# Altium schematic sheet SME_mic841.SchDoc: Titulo
size OrCAD A; Author: Ismael Poblete V.; CompanyName: SME; Organization: SME; Address1: Santiago, Chile; DocumentNumber: SME-UNO; Revision: 1.0; SheetNumber: 2; SheetTotal: 7
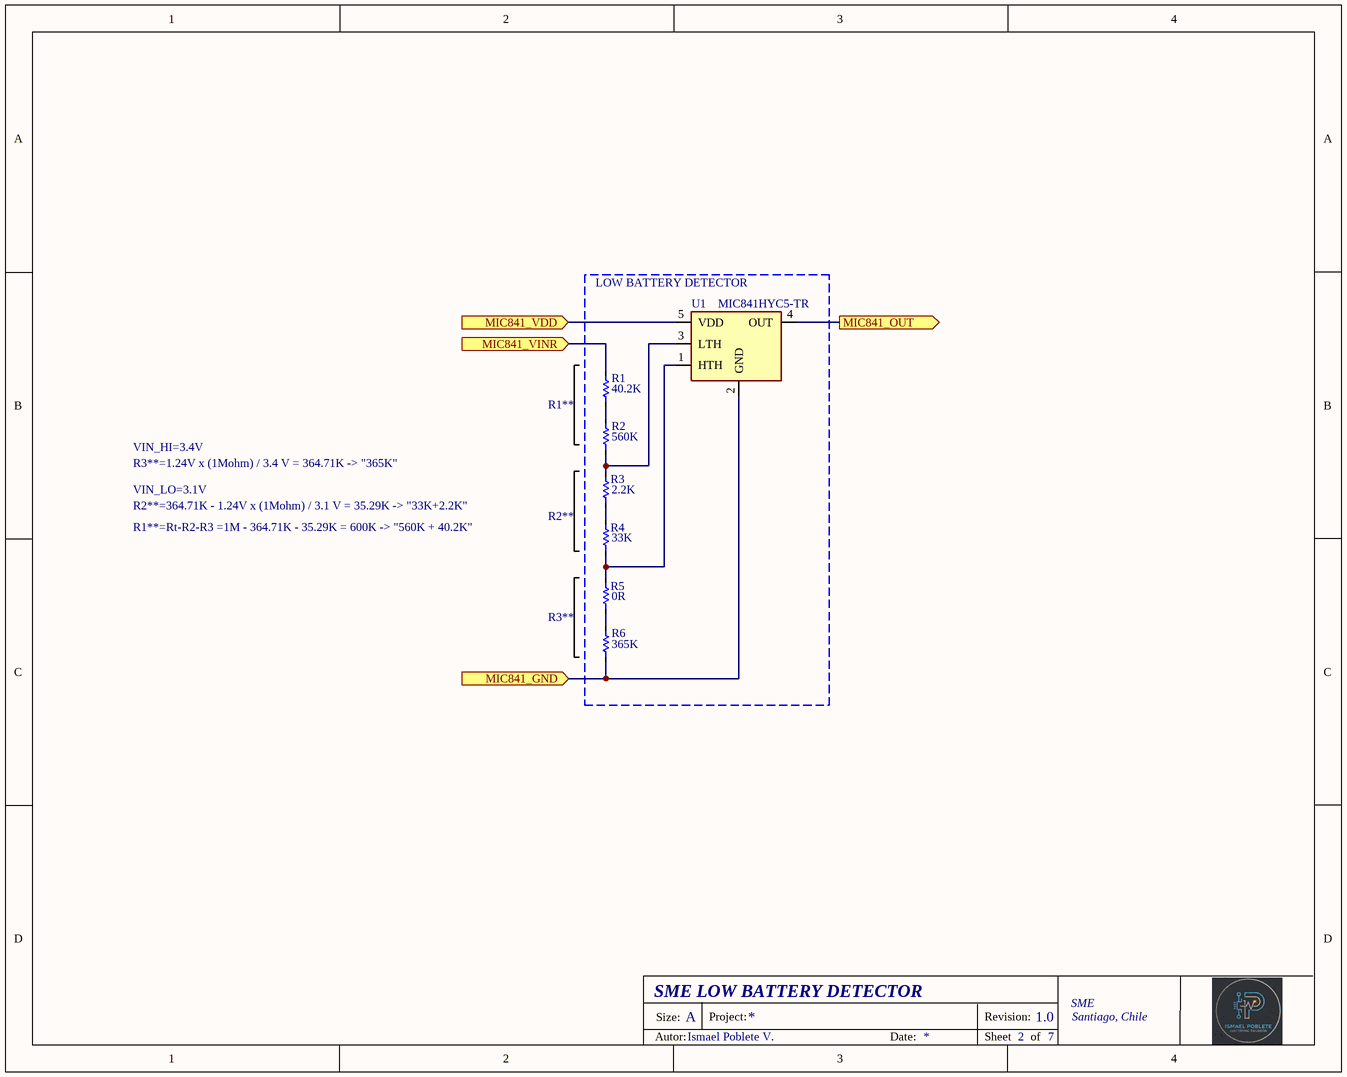
[diagram p0: SME_mic841.SchDoc]

## Parts
R1  Resistance: 40.2K  [RES_0805]  (hidden comment: RT0805FRE0740K2L)
R2  Resistance: 560K  [RES_0805]  (hidden comment: RT0805FRE07560KL)
R3  Resistance: 2.2K  [RES_0805]  (hidden comment: RT0805FRE072K2L)
R4  Resistance: 33K  [RES_0805]  (hidden comment: RT0805FRE0733KL)
R5  Resistance: 0R  [RES_0805]  (hidden comment: RC0805FR-100RL)
R6  Resistance: 365K  [RES_0805]  (hidden comment: RT0805FRE07365KL)
U1  MIC841HYC5-TR  [SOT65P210X110-5N]

## Blocks framed on the sheet
LOW BATTERY DETECTOR: R1-R6 U1

## Ports
MIC841_GND (in, see SME_Main[3B]), MIC841_OUT (out, see SME_Main[3B]), MIC841_VDD (in, see SME_Main[3B]), MIC841_VINR (in, see SME_Main[3B])

## Nets
MIC841_GND: R6.1 U1.2(GND) ; port MIC841_GND
MIC841_OUT: U1.4(OUT) ; port MIC841_OUT
MIC841_VDD: U1.5(VDD) ; port MIC841_VDD
MIC841_VINR: R1.2 ; port MIC841_VINR
NetR1_1: R1.1 R2.2
NetR2_1: R2.1 R3.2 U1.3(LTH)
NetR3_1: R3.1 R4.2
NetR4_1: R4.1 R5.2 U1.1(HTH)
NetR5_1: R5.1 R6.2

## Notes on the sheet
- R1**
- VIN_LO=3.1V
- VIN_HI=3.4V
- R3**=1.24V x (1Mohm) / 3.4 V = 364.71K -> "365K"
- R2**=364.71K - 1.24V x (1Mohm) / 3.1 V = 35.29K -> "33K+2.2K"
- R1**=Rt-R2-R3 =1M - 364.71K - 35.29K = 600K -> "560K + 40.2K"
- R2**
- R3**
- SME LOW BATTERY DETECTOR
- Size:
- A
- Project:
- Revision:
- Autor:
- Date:
- Sheet
- of

## Library data of the parts
R1 = RT0805FRE0740K2L: Thin Film Resistors - SMD 1/8W 40.2K ohm 1% 50ppm; Case/Package: 0805
R2 = RT0805FRE07560KL: Thin Film Resistors - SMD 1/8W 560K ohm 1% 50ppm; Case/Package: 0805
R3 = RT0805FRE072K2L: Thin Film Resistors - SMD 1/8W 2.2K ohm 1% 50p pm; Case/Package: 0805
R4 = RT0805FRE0733KL: Thin Film Resistors - SMD 1/8W 33K ohm 1% 50ppm; Case/Package: 0805
R5 = RC0805FR-100RL: Thick Film Resistors - SMD General Purpose Chip Resistor 0805, 0Ohms, 1%, 1/8W; Case/Package: 0805
R6 = RT0805FRE07365KL: Thin Film Resistors - SMD 1/8W 365K ohm 1% 50ppm; Case/Package: 0805
U1 = MIC841HYC5-TR: Microchip MIC841HYC5-TR Dual Comparator, Open Drain, Push-Pull O/P, 12us 1.5  5.5 V 5-Pin SC-70; Geometry.Height: 1.1mm; Mouser Part Number: 998-MIC841HYC5TR; Mouser Price/Stock: https://www.mouser.co.uk/ProductDetail/Microchip-Technology/MIC841HYC5-TR?qs=U6T8BxXiZAVOe5BH1VWqpQ%3D%3D; Manufacturer_Name: Microchip; Manufacturer_Part_Number: MIC841HYC5-TR; Datasheet Link: http://ww1.microchip.com/downloads/en/devicedoc/20005758a.pdf